# Altium project gelistirme_karti1.PrjPcb (part 1 of 2)
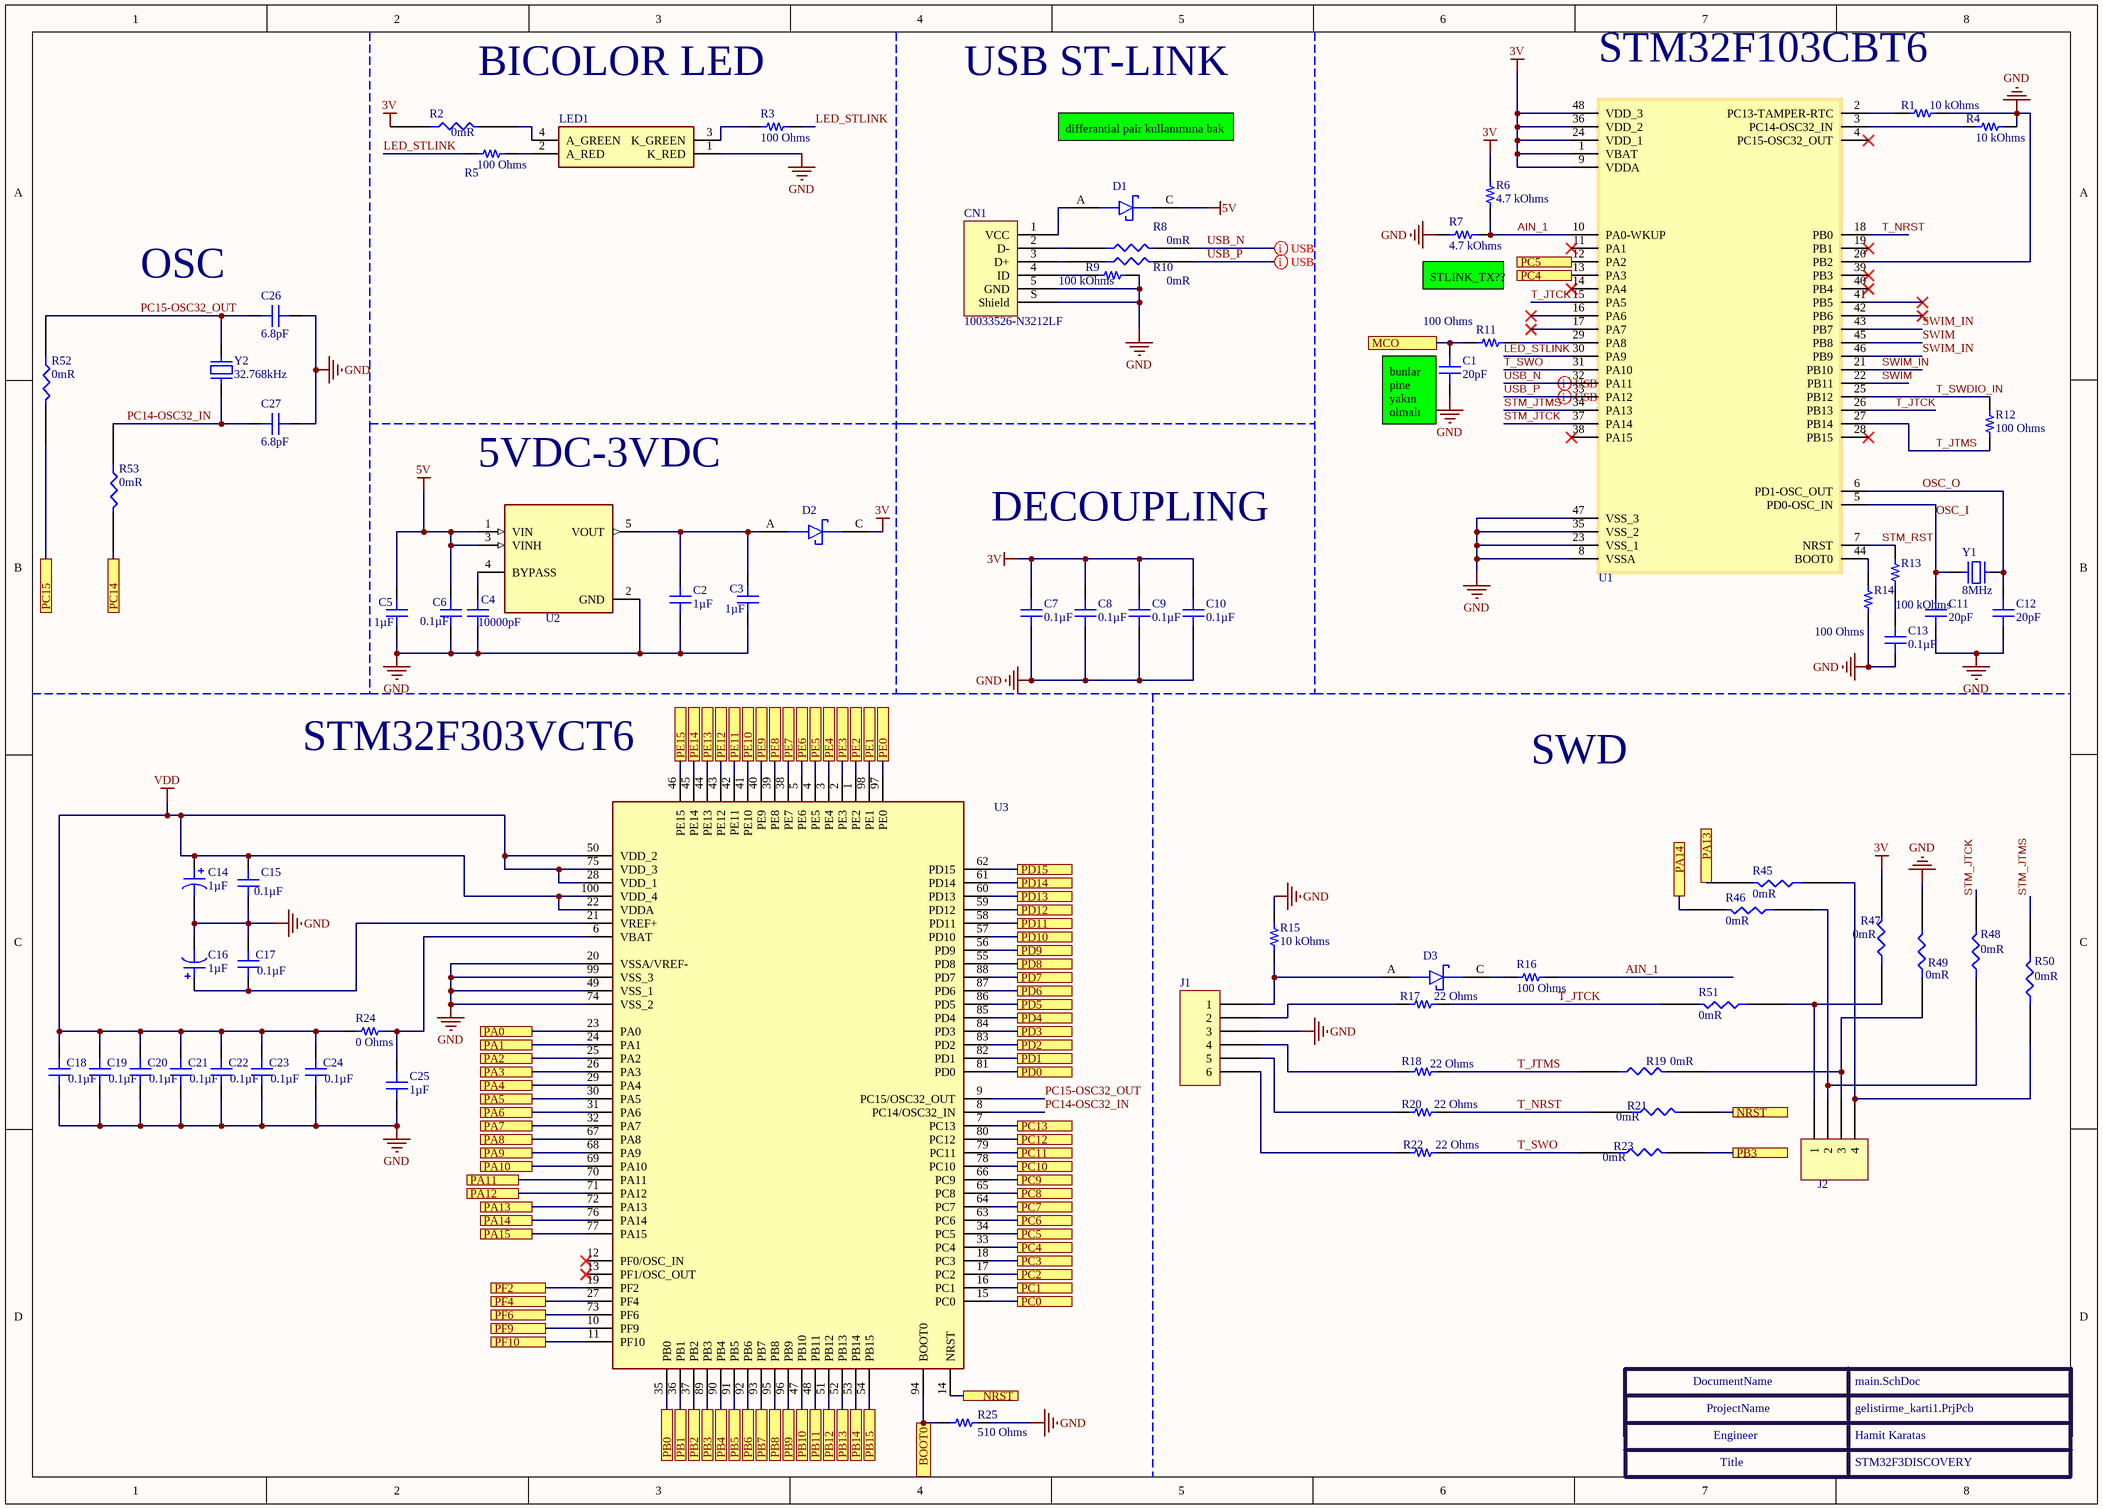
[diagram p0: main.SchDoc]
2 sheets, 118 parts. Net scope: flat (ports and power ports of the same name join across sheets).
Board file: PCB1.PcbDoc
Sheets:
  main.SchDoc
  IOandSensors.SchDoc

## Sheet main.SchDoc: STM32F3DISCOVERY
size A3; Engineer: Hamit Karatas; SheetNumber: 1; SheetTotal: 2

### Parts
C1  20pF  [CAP 0603_1608]
C2  1µF  [CAP 0603_1608]
C3  1µF  [CAP 0603_1608]
C4  10000pF  [CAP 0603_1608]
C5  1µF  [CAP 0603_1608]
C6  0.1µF  [CAP 0603_1608]
C7  0.1µF  [CAP 0603_1608]
C8  0.1µF  [CAP 0603_1608]
C9  0.1µF  [CAP 0603_1608]
C10  0.1µF  [CAP 0603_1608]
C11  20pF  [CAP 0603_1608]
C12  20pF  [CAP 0603_1608]
C13  0.1µF  [CAP 0603_1608]
C14  1µF  [CAP ALSMD POLY 4.3MM H5.5MM]
C15  0.1µF  [CAP 0603_1608]
C16  1µF  [CAP ALSMD POLY 4.3MM H5.5MM]
C17  0.1µF  [CAP 0603_1608]
C18  0.1µF  [CAP 0603_1608]
C19  0.1µF  [CAP 0603_1608]
C20  0.1µF  [CAP 0603_1608]
C21  0.1µF  [CAP 0603_1608]
C22  0.1µF  [CAP 0603_1608]
C23  0.1µF  [CAP 0603_1608]
C24  0.1µF  [CAP 0603_1608]
C25  1µF  [CAP 0603_1608]
C26  6.8pF  [CAP 0603_1608]
C27  6.8pF  [CAP 0603_1608]
CN1  10033526-N3212LF  [FCI USB 10033526-N3212LF]
D1  BAT60J  [SOD-323]  (value not drawn)
D2  BAT60J  [SOD-323]  (value not drawn)
D3  BAT60J  [SOD-323]  (value not drawn)
J1  B6B-PH-K(LF)(SN)  [JST B6B-PH-K]  (value not drawn)
J2  B4B-PH-K-S(LF)(SN)  [JST B4B-PH-K]  (value not drawn)
LED1  IN-S85DATRG  [INS85DATRG]  (value not drawn)
R1  10 kOhms  [RES 0603_1608]
R2  Resistance: 0mR  [RES_0603]  (hidden comment: RC0603JR-070RL)
R3  100 Ohms  [RES 0603_1608]
R4  10 kOhms  [RES 0603_1608]
R5  100 Ohms  [RES 0603_1608]
R6  4.7 kOhms  [RES 0603_1608]
R7  4.7 kOhms  [RES 0603_1608]
R8  Resistance: 0mR  [RES_0603]  (hidden comment: RC0603JR-070RL)
R9  100 kOhms  [RES 0603_1608]
R10  Resistance: 0mR  [RES_0603]  (hidden comment: RC0603JR-070RL)
R11  100 Ohms  [RES 0603_1608]
R12  100 Ohms  [RES 0603_1608]
R13  100 kOhms  [RES 0603_1608]
R14  100 Ohms  [RES 0603_1608]
R15  10 kOhms  [RES 0603_1608]
R16  100 Ohms  [RES 0603_1608]
R17  22 Ohms  [RES 0603_1608]
R18  22 Ohms  [RES 0603_1608]
R19  Resistance: 0mR  [RES_0603]  (hidden comment: RC0603JR-070RL)
R20  22 Ohms  [RES 0603_1608]
R21  Resistance: 0mR  [RES_0603]  (hidden comment: RC0603JR-070RL)
R22  22 Ohms  [RES 0603_1608]
R23  Resistance: 0mR  [RES_0603]  (hidden comment: RC0603JR-070RL)
R24  0 Ohms  [RES 0603_1608]
R25  510 Ohms  [RES 0603_1608]
R45  Resistance: 0mR  [RES_0603]  (hidden comment: RC0603JR-070RL)
R46  Resistance: 0mR  [RES_0603]  (hidden comment: RC0603JR-070RL)
R47  Resistance: 0mR  [RES_0603]  (hidden comment: RC0603JR-070RL)
R48  Resistance: 0mR  [RES_0603]  (hidden comment: RC0603JR-070RL)
R49  Resistance: 0mR  [RES_0603]  (hidden comment: RC0603JR-070RL)
R50  Resistance: 0mR  [RES_0603]  (hidden comment: RC0603JR-070RL)
R51  Resistance: 0mR  [RES_0603]  (hidden comment: RC0603JR-070RL)
R52  Resistance: 0mR  [RES_0603]  (hidden comment: RC0603JR-070RL)
R53  Resistance: 0mR  [RES_0603]  (hidden comment: RC0603JR-070RL)
U1  IC MCU 32BIT 128KB FLASH 48LQFP  [STM32F103CBT6]  (value not drawn)
U2  LD3985M33R  [SOT23-T]  (value not drawn)
U3  STM32F303VCT6  [LQFP-100]  (value not drawn)
Y1  8MHz  [ABRACON ABLS]
Y2  32.768kHz  [ABRACON ABS07]

### Ports
BOOT0, MCO, NRST, PA0, PA1, PA2, PA3, PA4, PA5, PA6, PA7, PA8, PA9, PA10, PA11, PA12, PA13, PA14, PA15, PB0, PB1, PB2, PB3, PB4, PB5, PB6, PB7, PB8, PB9, PB10, PB11, PB12, PB13, PB14, PB15, PC0, PC1, PC2, PC3, PC4, PC5, PC6, PC7, PC8, PC9, PC10, PC11, PC12, PC13, PC14, PC15, PD0, PD1, PD2, PD3, PD4, PD5, PD6, PD7, PD8, PD9, PD10, PD11, PD12, PD13, PD14, PD15, PE0, PE1, PE2, PE3, PE4, PE5, PE6, PE7, PE8, PE9, PE10, PE11, PE12, PE13, PE14, PE15, PF2, PF4, PF6, PF9, PF10

### Nets
3V: C7.2 C8.2 C9.2 C10.2 D2.C R2.1 R6.1 R47.2 U1.1(VBAT) U1.9(VDDA) U1.24(VDD_1) U1.36(VDD_2) U1.48(VDD_3)
5V: C5.2 C6.2 D1.C U2.1(VIN) U2.3(VINH)
GND: C1.1 C2.1 C3.1 C4.1 C5.1 C6.1 C7.1 C8.1 C9.1 C10.1 C11.1 C12.1 C13.1 C14.2 C15.1 C16.2 C17.2 C18.1 C19.1 C20.1 C21.1 C22.1 C23.1 C24.1 C25.1 C26.1 C27.1 CN1.5(GND) CN1.S(Shield) J1.3 LED1.1(K_RED) R1.2 R4.2 R7.2 R9.2 R14.1 R15.2 R25.2 R49.2 U1.8(VSSA) U1.20(PB2) U1.23(VSS_1) U1.35(VSS_2) U1.47(VSS_3) U2.2(GND) U3.20(VSSA/VREF-) U3.49(VSS_1) U3.74(VSS_2) U3.99(VSS_3)
VDD: C14.1 C15.2 C18.2 C19.2 C20.2 C21.2 C22.2 C23.2 C24.2 R24.2 U3.22(VDDA) U3.28(VDD_1) U3.50(VDD_2) U3.75(VDD_3) U3.100(VDD_4)
AIN_1: R6.2 R7.1 R16.2 U1.10(PA0-WKUP)
LED_STLINK: R3.2 R5.1 U1.30(PA9)
OSC_I: C11.2 U1.5(PD0-OSC_IN) Y1.2
OSC_O: C12.2 U1.6(PD1-OSC_OUT) Y1.1
PA9: U3.68(PA9) ; port PA9
PA13: R45.2 U3.72(PA13) ; port PA13
PA15: U3.77(PA15) ; port PA15
PB3: R23.2 U3.89(PB3) ; port PB3
PB5: U3.91(PB5) ; port PB5
PB7: U3.93(PB7) ; port PB7
PB9: U3.96(PB9) ; port PB9
PC9: U3.66(PC9) ; port PC9
PC11: U3.79(PC11) ; port PC11
PC13: U3.7(PC13) ; port PC13
PC14-OSC32_IN: C27.2 R53.1 U3.8(PC14/OSC32_IN) Y2.1
PC15: R52.2 ; port PC15
PC15-OSC32_OUT: C26.2 R52.1 U3.9(PC15/OSC32_OUT) Y2.2
PD0: U3.81(PD0) ; port PD0
PD2: U3.83(PD2) ; port PD2
PD4: U3.85(PD4) ; port PD4
PD6: U3.87(PD6) ; port PD6
PE1: U3.98(PE1) ; port PE1
PE3: U3.2(PE3) ; port PE3
PE5: U3.4(PE5) ; port PE5
PF10: U3.11(PF10) ; port PF10
STM_JTCK: R48.2 U1.37(PA14)
STM_JTMS: R50.2 U1.34(PA13)
STM_RST: R13.2 U1.7(NRST)
SWIM: U1.22(PB11) U1.45(PB8)
SWIM_IN: U1.21(PB10) U1.43(PB7) U1.46(PB9)
T_JTCK: R17.2 R51.2 U1.15(PA5) U1.26(PB13)
T_JTMS: R12.1 R18.2 R19.1 U1.27(PB14)
T_NRST: R20.2 R21.1 U1.18(PB0)
T_SWDIO_IN: R12.2 U1.25(PB12)
T_SWO: R22.2 R23.1 U1.31(PA10)
USB_N: R8.2 U1.32(PA11)
USB_P: R10.2 U1.33(PA12)
NetC1_2: C1.2 R11.2 ; port MCO
NetC2_2: C2.2 C3.2 D2.A U2.5(VOUT)
NetC4_2: C4.2 U2.4(BYPASS)
NetC13_2: C13.2 R13.1
NetC16_1: C16.1 C17.1 U3.21(VREF+)
NetC25_2: C25.2 R24.1 U3.6(VBAT)
NetCN1_1: CN1.1(VCC) D1.A
NetCN1_2: CN1.2(D-) R8.1
NetCN1_3: CN1.3(D+) R10.1
NetCN1_4: CN1.4(ID) R9.1
NetD3_A: D3.A J1.1 R15.1
NetD3_C: D3.C R16.1
NetJ1_2: J1.2 R17.1
NetJ1_4: J1.4 R18.1
NetJ1_5: J1.5 R20.1
NetJ1_6: J1.6 R22.1
NetJ2_1: J2.1 R47.1 R51.1
NetJ2_2: J2.2 R46.1 R48.1
NetJ2_3: J2.3 R19.2 R49.1
NetJ2_4: J2.4 R45.1 R50.1
NetLED1_2: LED1.2(A_RED) R5.2
NetLED1_3: LED1.3(K_GREEN) R3.1
NetLED1_4: LED1.4(A_GREEN) R2.2
NetP1_3: U3.10(PF9) ; port PF9
NetP1_7: R53.2 ; port PC14
NetP1_9: U3.5(PE6) ; port PE6
NetP1_11: U3.3(PE4) ; port PE4
NetP1_13: U3.1(PE2) ; port PE2
NetP1_15: U3.97(PE0) ; port PE0
NetP1_17: U3.95(PB8) ; port PB8
NetP1_19: R25.1 U3.94(BOOT0) ; port BOOT0
NetP1_21: U3.92(PB6) ; port PB6
NetP1_23: U3.90(PB4) ; port PB4
NetP1_25: U3.88(PD7) ; port PD7
NetP1_27: U3.86(PD5) ; port PD5
NetP1_29: U3.84(PD3) ; port PD3
NetP1_31: U3.82(PD1) ; port PD1
NetP1_33: U3.80(PC12) ; port PC12
NetP1_35: U3.78(PC10) ; port PC10
NetP1_37: R46.2 U3.76(PA14) ; port PA14
NetP1_39: U3.73(PF6) ; port PF6
NetP1_41: U3.71(PA12) ; port PA12
NetP1_42: U3.70(PA11) ; port PA11
NetP1_43: U3.69(PA10) ; port PA10
NetP1_45: U3.67(PA8) ; port PA8
NetP1_47: U3.65(PC8) ; port PC8
NetP2_4: R21.2 U3.14(NRST) ; port NRST
NetP2_5: U3.16(PC1) ; port PC1
NetP2_6: U3.15(PC0) ; port PC0
NetP2_7: U3.18(PC3) ; port PC3
NetP2_8: U3.17(PC2) ; port PC2
NetP2_9: U3.24(PA1) ; port PA1
NetP2_10: U3.19(PF2) ; port PF2
NetP2_11: U3.26(PA3) ; port PA3
NetP2_12: U3.23(PA0) ; port PA0
NetP2_13: U3.27(PF4) ; port PF4
NetP2_14: U3.25(PA2) ; port PA2
NetP2_15: U3.30(PA5) ; port PA5
NetP2_16: U3.29(PA4) ; port PA4
NetP2_17: U3.32(PA7) ; port PA7
NetP2_18: U3.31(PA6) ; port PA6
NetP2_19: U1.12(PA2) U3.34(PC5) ; port PC5
NetP2_20: U1.13(PA3) U3.33(PC4) ; port PC4
NetP2_21: U3.36(PB1) ; port PB1
NetP2_22: U3.35(PB0) ; port PB0
NetP2_23: U3.38(PE7) ; port PE7
NetP2_24: U3.37(PB2) ; port PB2
NetP2_25: U3.40(PE9) ; port PE9
NetP2_26: U3.39(PE8) ; port PE8
NetP2_27: U3.42(PE11) ; port PE11
NetP2_28: U3.41(PE10) ; port PE10
NetP2_29: U3.44(PE13) ; port PE13
NetP2_30: U3.43(PE12) ; port PE12
NetP2_31: U3.46(PE15) ; port PE15
NetP2_32: U3.45(PE14) ; port PE14
NetP2_33: U3.48(PB11) ; port PB11
NetP2_34: U3.47(PB10) ; port PB10
NetP2_35: U3.52(PB13) ; port PB13
NetP2_36: U3.51(PB12) ; port PB12
NetP2_37: U3.54(PB15) ; port PB15
NetP2_38: U3.53(PB14) ; port PB14
NetP2_39: U3.56(PD9) ; port PD9
NetP2_40: U3.55(PD8) ; port PD8
NetP2_41: U3.58(PD11) ; port PD11
NetP2_42: U3.57(PD10) ; port PD10
NetP2_43: U3.60(PD13) ; port PD13
NetP2_44: U3.59(PD12) ; port PD12
NetP2_45: U3.62(PD15) ; port PD15
NetP2_46: U3.61(PD14) ; port PD14
NetP2_47: U3.63(PC6) ; port PC6
NetP2_48: U3.64(PC7) ; port PC7
NetR1_1: R1.1 U1.2(PC13-TAMPER-RTC)
NetR4_1: R4.1 U1.3(PC14-OSC32_IN)
NetR11_1: R11.1 U1.29(PA8)
NetR14_2: R14.2 U1.44(BOOT0)

Not connected (* = marked no-connect by the designer): U1 4(PC15-OSC32_OUT)* 11(PA1)* 14(PA4)* 16(PA6)* 17(PA7)* 19(PB1)* 28(PB15)* 38(PA15)* 39(PB3)* 40(PB4)* 41(PB5)* 42(PB6)*; U3 12(PF0/OSC_IN)* 13(PF1/OSC_OUT)*

### Layout directives
differential pair: USB_N, USB_P

### Notes on the sheet
- BICOLOR LED
- USB ST-LINK
- STM32F103CBT6
- differantial pair kullanımına bak
- OSC
- (near R7) STLINK_TX??
- (near C1) bunlar pine yakın olmalı
- 5VDC-3VDC
- DECOUPLING
- (near U3) STM32F303VCT6
- SWD
- DocumentName
- ProjectName
- Engineer
- Title

### Library data of the parts
C1 C11 C12 = SQCSVA200JAT1A: CAP CER 20PF 250V 0603; Manufacturer: AVX Corporation; Temperature Coefficient: A; Tolerance: ±5%; Part Number: SQCSVA200JAT1A; Value: 20pF; Applications: RF, Microwave, High Frequency; Capacitance: 20pF; ComponentLink1Description: Datasheet; ComponentLink1URL: http://datasheets.avx.com/sqcs-sqcf.pdf; ComponentLink2Description: DigiKey Link; ComponentLink2URL: http://digikey.com/product-detail/en/avx-corporation/SQCSVA200JAT1A/478-3506-1-ND/1000465; Device Package: 0603 (1608 Metric); Features: High Q, Low Loss; LastUpdated: 2.09.2020 01:03:34; Lifecycle Status: Active; Minimum Order: 1; Mounting Type: Surface Mount, MLCC; Operating Temperature: -55°C ~ 125°C; Package / Case: 0603 (1608 Metric); Packaging: TapeAndReel; PartId: 2985; Part Status: Active; Price: 0.22; Series: SQ; Size / Dimension: 0.063" L x 0.032" W (1.60mm x 0.81mm); Supplier 1: DigiKey; Supplier Part Number 1: 478-3506-1-ND; Thickness (Max): 0.030" (0.76mm); Voltage - Rated: 250V
C2 C3 C5 C25 = C0603C105K4RACAUTO: CAP CER 0603 1UF 16V X7R 10%; Manufacturer: KEMET; Part Number: C0603C105K4RACAUTO; Value: 1µF; Applications: Automotive, Bypass, Decoupling; Capacitance: 1µF; ComponentLink1Description: Datasheet; ComponentLink1URL: https://api.kemet.com/component-edge/download/datasheet/C0603C105K4RACAUTO.pdf; ComponentLink2Description: DigiKey Link; ComponentLink2URL: http://digikey.com/product-detail/en/kemet/C0603C105K4RACAUTO/399-17704-1-ND/8635855; Device Package: 0603 (1608 Metric); LastUpdated: 2.09.2020 01:03:36; Lifecycle Status: Active; Minimum Order: 1; Mounting Type: Surface Mount, MLCC; Operating Temperature: -55°C ~ 125°C; Package / Case: 0603 (1608 Metric); Packaging: TapeAndReel; PartId: 2179; Part Status: Active; Price: 0.02; Ratings: AEC-Q200; Series: SMD Auto X7R; Size / Dimension: 0.063" L x 0.031" W (1.60mm x 0.80mm); Supplier 1: DigiKey; Supplier Part Number 1: 399-17704-1-ND; Temperature Coefficient: X7R; Thickness (Max): 0.037" (0.95mm); Tolerance: ±10%; Voltage - Rated: 16V
C4 = C0603X103K1RAC3316: CAP CER 0603 10NF 100V X7R; Manufacturer: KEMET; Tolerance: ±10%; Part Number: C0603X103K1RAC3316; Value: 10000pF; Applications: Automotive, Boardflex Sensitive; Capacitance: 10000pF; ComponentLink1Description: Datasheet; ComponentLink1URL: https://api.kemet.com/component-edge/download/datasheet/C0603X103K1RAC3316.pdf; ComponentLink2Description: DigiKey Link; ComponentLink2URL: http://digikey.com/product-detail/en/kemet/C0603X103K1RAC3316/399-C0603X103K1RAC3316CT-ND/10315834; Device Package: 0603 (1608 Metric); Features: Soft Termination; LastUpdated: 2.09.2020 01:03:25; Lifecycle Status: Active; Minimum Order: 1; Mounting Type: Surface Mount, MLCC; Operating Temperature: -55°C ~ 125°C; Package / Case: 0603 (1608 Metric); Packaging: TapeAndReel; PartId: 8591; Part Status: Active; Price: 0.09; Ratings: AEC-Q200; Series: SMD Auto X7R VW80808; Size / Dimension: 0.063" L x 0.031" W (1.60mm x 0.80mm); Supplier 1: DigiKey; Supplier Part Number 1: 399-C0603X103K1RAC3316CT-ND; Temperature Coefficient: X7R; Thickness (Max): 0.037" (0.95mm); Voltage - Rated: 100V
C6-C10 C13 C15 C17-C24 = C0603C104K5RAC7411: CAP CER 0.1UF 50V X7R 0603; Manufacturer: KEMET; Tolerance: ±10%; Part Number: C0603C104K5RAC7411; Value: 0.1µF; Applications: Bypass, Decoupling; Capacitance: 0.1µF; ComponentLink1Description: Datasheet; ComponentLink1URL: https://api.kemet.com/component-edge/download/datasheet/C0603C104K5RAC7411.pdf; ComponentLink2Description: DigiKey Link; ComponentLink2URL: http://digikey.com/product-detail/en/kemet/C0603C104K5RAC7411/399-7374-2-ND/3317013; Device Package: 0603 (1608 Metric); LastUpdated: 2.09.2020 01:03:36; Lifecycle Status: Active; Minimum Order: 15000; Mounting Type: Surface Mount, MLCC; Operating Temperature: -55°C ~ 125°C; Package / Case: 0603 (1608 Metric); Packaging: TapeAndReel; PartId: 2233; Part Status: Active; Price: 0.02; Series: SMD Comm X7R; Size / Dimension: 0.063" L x 0.031" W (1.60mm x 0.80mm); Supplier 1: DigiKey; Supplier Part Number 1: 399-7374-2-ND; Temperature Coefficient: X7R; Thickness (Max): 0.035" (0.90mm); Voltage - Rated: 50V
C14 C16 = EEE-1HA010NR: CAP ALUM 1UF 20% 50V SMD; Manufacturer: Panasonic Electronic Components; Lifetime @ Temp.: 2000 Hrs @ 85°C; Polarization: Bi-Polar; Ripple Current @ High Frequency: 17mA @ 10kHz; Ripple Current @ Low Frequency: 10mA @ 120Hz; Surface Mount Land Size: 0.169" L x 0.169" W (4.30mm x 4.30mm); Part Number: EEE-1HA010NR; Applications: Automotive; Capacitance: 1µF; ComponentLink1Description: Datasheet; ComponentLink1URL: //media.digikey.com/pdf/Data%20Sheets/Panasonic%20Electronic%20Components/S_Series,Type_V_Rev2018.pdf; ComponentLink2Description: DigiKey Link; ComponentLink2URL: http://digikey.com/product-detail/en/panasonic-electronic-components/EEE-1HA010NR/PCE4301CT-ND/946236; Device Package: Radial, Can - SMD; Height - Seated (Max): 0.213" (5.40mm); LastUpdated: 2.09.2020 01:23:46; Lifecycle Status: Active; Minimum Order: 1; Mounting Type: Surface Mount; Operating Temperature: -40°C ~ 85°C; Package / Case: Radial, Can - SMD; Packaging: TapeAndReel; PartId: 7035; Part Status: Active; Price: 0.08; Ratings: AEC-Q200; Series: S; Size / Dimension: 0.157" Dia (4.00mm); Supplier 1: DigiKey; Supplier Part Number 1: PCE4301CT-ND; Tolerance: ±20%; Value: 1µF; Voltage - Rated: 50V
C26 C27 = C0603C689J5GACTU: CAP CER 6.8PF 50V C0G/NP0 0603; Manufacturer: KEMET; Temperature Coefficient: C0G, NP0; Tolerance: ±5%; Part Number: C0603C689J5GACTU; Value: 6.8pF; Applications: General Purpose; Capacitance: 6.8pF; ComponentLink1Description: Datasheet; ComponentLink1URL: https://api.kemet.com/component-edge/download/datasheet/C0603C689J5GACTU.pdf; ComponentLink2Description: DigiKey Link; ComponentLink2URL: http://digikey.com/product-detail/en/kemet/C0603C689J5GACTU/399-7957-1-ND/3471680; Device Package: 0603 (1608 Metric); Features: Low ESL; LastUpdated: 2.09.2020 01:03:35; Lifecycle Status: Active; Minimum Order: 1; Mounting Type: Surface Mount, MLCC; Operating Temperature: -55°C ~ 125°C; Package / Case: 0603 (1608 Metric); Packaging: TapeAndReel; PartId: 2398; Part Status: Active; Price: 0.08; Series: SMD Comm C0G; Size / Dimension: 0.063" L x 0.031" W (1.60mm x 0.80mm); Supplier 1: DigiKey; Supplier Part Number 1: 399-7957-1-ND; Thickness (Max): 0.034" (0.87mm); Voltage - Rated: 50V
CN1 = 10033526-N3212LF: CONN RCPT MINI USB B 5POS SMD RA; Manufacturer: Amphenol ICC (FCI); Connector Type: USB - mini B; Current Rating (Amps): 1A per Contact; Gender: Receptacle; Mating Cycles: 5000; Number of Contacts: 5; Number of Ports: 1; Shielding: Shielded; Voltage - Rated: 30V; Part Number: 10033526-N3212LF; ComponentLink1Description: Datasheet; ComponentLink1URL: http://www.amphenol-icc.com/media/wysiwyg/files/drawing/10033526.pdf; ComponentLink2Description: DigiKey Link; ComponentLink2URL: //digikey.com/product-detail/en/amphenol-icc-fci/10033526-N3212LF/609-4700-2-ND/4292074; Features: Board Guide, Solder Retention; LastUpdated: 9.12.2019 20:52:14; Lifecycle Status: 0; Minimum Order: 1; Mounting Feature: Horizontal; Mounting Type: Surface Mount, Right Angle; Operating Temperature: -25°C ~ 85°C; Packaging: TapeAndReel; Part Status: Active; Price: 0.39; Series: -; Supplier 1: DigiKey; Supplier Part Number 1: 609-4700-2-ND; Termination: Solder
D1-D3 = DIODE SCHOTTKY: STMICROELECTRONICS - BAT60JFILM - Small Signal Schottky Diode, Single, 10 V, 3 A, 580 mV, 5 A, 150 °C; Forward Current: 3A; Max Reverse Current: 7.5uA; Peak Non-Repetitive Surge Current: 5A; Max Repetitive Reverse Voltage (Vrrm): 10V; Forward Voltage: 580mV; Polarity: Standard; Supplier 1: RSComponents; Manufacturer: STMicroelectronics; Manufacturer Part Number: BAT60JFILM; RoHS: Yes; Category: Rectifier Diodes; Stock 1: 1; Pricing 1: 100=0,09000, 500=0,08700, 1000=0,08500, 2500=0,08300, 5000=0,08100 (USD); Mount: Surface Mount; Number of Pins: 2; Weight: 0.01lb; Contact Plating: Tin,Matte; Min Operating Temperature: -65°C; Max Operating Temperature: 150°C; Element Configuration: Single; Packaging: Tape and Reel; Package Quantity: 1; Average Rectified Current: 3A; Voltage Rating (DC): 10V; Output Current: 3A; Current Rating: 3A; Max Reverse Voltage (DC): 10V; Series: -; Max Surge Current: 5A; Max Reverse Leakage Current: 7.5uA; Max Forward Surge Current (Ifsm): 5A; Length: 1.8mm; Width: 1.45mm; Height: 1.07mm; Radiation Hardening: No; Lead Free: Lead Free; RoHS Compliant: Yes; REACH SVHC: No SVHC; ComponentLink1URL: https://datasheet.ciiva.com/23916/cd00001944-23916545.pdf?src-supplier=Newark; ComponentLink1Description: https://datasheet.ciiva.com/23916/cd00001944-23916545.pdf?src-supplier=Newark; ComponentLink2URL: https://datasheet.ciiva.com/4714/cd00001944-96586-4714681.pdf?src-supplier=Mouser; ComponentLink2Description: https://datasheet.ciiva.com/4714/cd00001944-96586-4714681.pdf?src-supplier=Mouser; ComponentLink3URL: https://datasheet.ciiva.com/17078/bat60jfilm-17078717.pdf?src-supplier=Allied+Electronics; ComponentLink3Description: https://datasheet.ciiva.com/17078/bat60jfilm-17078717.pdf?src-supplier=Allied+Electronics; ComponentLink4URL: https://datasheet.ciiva.com/1200/1689728-1200741.pdf?src-supplier=Farnell; ComponentLink4Description: https://datasheet.ciiva.com/1200/1689728-1200741.pdf?src-supplier=Farnell; ComponentLink5URL: https://datasheet.ciiva.com/15144/getdatasheetpartid-91415-15144683.pdf?src-supplier=Verical; ComponentLink5Description: https://datasheet.ciiva.com/15144/getdatasheetpartid-91415-15144683.pdf?src-supplier=Verical; ComponentLink6URL: https://datasheet.ciiva.com/915/cd00001944-915607.pdf?src-supplier=Digi-Key; ComponentLink6Description: https://datasheet.ciiva.com/915/cd00001944-915607.pdf?src-supplier=Digi-Key; ComponentLink7URL: https://datasheet.ciiva.com/915/cd00001944-915608.pdf?src-supplier=Digi-Key; ComponentLink7Description: https://datasheet.ciiva.com/915/cd00001944-915608.pdf?src-supplier=Digi-Key; ComponentLink8URL: https://datasheet.ciiva.com/915/cd00001944-915609.pdf?src-supplier=Digi-Key; ComponentLink8Description: https://datasheet.ciiva.com/915/cd00001944-915609.pdf?src-supplier=Digi-Key; Supplier Part Number 1: 7146879
J1 = B6B-PH-K(LF)(SN): CONN HEADER VERT 6POS 2MM; Manufacturer: JST Sales America Inc.; Contact Length - Mating: 0.130" (3.30mm); Contact Length - Post: 0.134" (3.40mm); Current Rating (Amps): 2A; Material Flammability Rating: UL94 V-0; Number of Positions: 6; Number of Positions Loaded: All; Overall Contact Length: 0.333" (8.45mm); Pitch - Mating: 0.079" (2.00mm); Shrouding: Shrouded - 4 Wall; Style: Board to Cable/Wire; Voltage Rating: 100V; Part Number: B6B-PH-K(LF)(SN); ComponentLink1Description: Datasheet; ComponentLink1URL: http://www.jst-mfg.com/product/pdf/eng/ePH.pdf; ComponentLink2Description: DigiKey Link; ComponentLink2URL: http://digikey.com/product-detail/en/jst-sales-america-inc/B6B-PH-K-LF-SN/455-2923-ND/2741628; Connector Type: Header; Contact Finish - Mating: Tin; Contact Finish - Post: Tin; Contact Material: Brass; Contact Shape: Square; Contact Type: Male Pin; Fastening Type: Detent Lock; Insulation Color: Ivory; Insulation Height: 0.236" (6.00mm); Insulation Material: Polyamide (PA66), Nylon 6/6; LastUpdated: 12.01.2020 22:30:17; Lifecycle Status: Active; Minimum Order: 1; Mounting Type: Through Hole; Number of Rows: 1; Operating Temperature: -25°C ~ 85°C; Packaging: Bulk; PartId: 29; Part Status: Active; Price: 0.34; Series: PH; Supplier 1: DigiKey; Supplier Part Number 1: 455-2923-ND; Termination: Press-Fit, Solder
J2 = B4B-PH-K-S(LF)(SN): CONN HEADER VERT 4POS 2MM; Manufacturer: JST Sales America Inc.; Contact Length - Mating: 0.130" (3.30mm); Contact Length - Post: 0.134" (3.40mm); Current Rating (Amps): 2A; Material Flammability Rating: UL94 V-0; Number of Positions: 4; Number of Positions Loaded: All; Overall Contact Length: 0.333" (8.45mm); Pitch - Mating: 0.079" (2.00mm); Shrouding: Shrouded - 4 Wall; Style: Board to Cable/Wire; Voltage Rating: 100V; Part Number: B4B-PH-K-S(LF)(SN); ComponentLink1Description: Datasheet; ComponentLink1URL: http://www.jst-mfg.com/product/pdf/eng/ePH.pdf; ComponentLink2Description: DigiKey Link; ComponentLink2URL: http://digikey.com/product-detail/en/jst-sales-america-inc/B4B-PH-K-S-LF-SN/455-1706-ND/926613; Connector Type: Header; Contact Finish - Mating: Tin; Contact Finish - Post: Tin; Contact Material: Brass; Contact Shape: Square; Contact Type: Male Pin; Fastening Type: Detent Lock; Insulation Color: Natural; Insulation Height: 0.236" (6.00mm); Insulation Material: Polyamide (PA66), Nylon 6/6; LastUpdated: 12.01.2020 22:29:40; Lifecycle Status: Active; Minimum Order: 1; Mounting Type: Through Hole; Number of Rows: 1; Operating Temperature: -25°C ~ 85°C; Packaging: Bulk; PartId: 27; Part Status: Active; Price: 0.24; Series: PH; Supplier 1: DigiKey; Supplier Part Number 1: 455-1706-ND; Termination: Press-Fit, Solder
LED1 = IN-S85DATRG: LED; Manufacturer_Name: Inolux; Datasheet Link: http://www.inolux-corp.com/datasheet/SMDLED/Bi-Color%20Top%20View/IN-S85DATRG_V1.0.pdf; Height: 1.1mm; Manufacturer_Part_Number: IN-S85DATRG; Mouser Part Number: 743-IN-S85DATRG; Mouser Price/Stock: https://www.mouser.co.uk/ProductDetail/Inolux/IN-S85DATRG/?qs=fAHHVMwC%252BbiJ35CU790Hbw%3D%3D; Arrow Part Number: IN-S85DATRG; Arrow Price/Stock: https://www.arrow.com/en/products/in-s85datrg/inolux-corporation
R1 R4 R15 = RT0603DRD0710KL: RES SMD 10K OHM 0.5% 1/10W 0603; Manufacturer: Yageo; Power (Watts): 0.1W, 1/10W; Temperature Coefficient: ±25ppm/°C; Part Number: RT0603DRD0710KL; Value: 10 kOhms; ComponentLink1Description: Datasheet; ComponentLink1URL: https://www.yageo.com/upload/media/product/productsearch/datasheet/rchip/PYu-RT_1-to-0.01_RoHS_L_11.pdf; ComponentLink2Description: DigiKey Link; ComponentLink2URL: http://digikey.com/product-detail/en/yageo/RT0603DRD0710KL/311-10KDCT-ND/1035680; Composition: Thin Film; Device Package: 0603 (1608 Metric); Height - Seated (Max): 0.022" (0.55mm); LastUpdated: 2.09.2020 01:10:23; Lifecycle Status: Active; Minimum Order: 1; Number of Terminations: 2; Operating Temperature: -55°C ~ 155°C; Package / Case: 0603 (1608 Metric); Packaging: TapeAndReel; PartId: 5487; Part Status: Active; Price: 0.02; Resistance: 10 kOhms; Series: RT; Size / Dimension: 0.063" L x 0.031" W (1.60mm x 0.80mm); Supplier 1: DigiKey; Supplier Part Number 1: 311-10KDCT-ND; Supplier Device Package: 0603; Tolerance: ±0.5%
R2 R8 R10 R19 R21 R23 R45-R53 = Res 0 ohm 0603: RES SMD 0 OHM JUMPER 1/10W 0603; Manufacturer: Yageo; Designed by: Hamit; Tolerance: 1%; Power Rating: 100mW; Voltage Rating (DC): 50V; Temperature Coefficient: 200ppm/°C; Resistance Tolerance: 5%; Supplier 1: Digi-Key; Manufacturer Part Number: RC0603JR-070RL; RoHS: Yes; Category: Chip SMD Resistors; Stock 1: 6474034; Pricing 1: 1=0,10000, 10=0,01700, 25=0,01240, 50=0,00940, 100=0,00700, 250=0,00532, 500=0,00424, 1000=0,00313 (USD); Case/Package: 0603; Number of Pins: 2; Contact Plating: Tin,Matte; Case Code (Imperial): 0603; Case Code (Metric): 1608; Size Code: 0603; Min Operating Temperature: -55°C; Max Operating Temperature: 155°C; Resistor Type: Thick Film; Packaging: Tape and Reel; Termination: SMD/SMT; Series: RC; Technology: THICK FILM; Package Quantity: 5000; Voltage Rating: 50V; Features: Moisture Resistant; Max Power Dissipation: 100mW; Number of Terminations: 2; Construction: Rectangular; Length: 1.6mm; Width: 0.8mm; Height: 0.45mm; Depth: 0.8mm; Radiation Hardening: No; REACH SVHC: No SVHC; Lead Free: Lead Free; RoHS Compliant: Yes; Military Standard: Not; Supplier Part Number 1: 311-0.0GRDKR-ND
R3 R5 R11 R12 R14 R16 = RNCS0603BKE100R: RES 100 OHM 0.1% 1/16W 0603; Manufacturer: Stackpole Electronics Inc; Power (Watts): 0.063W, 1/16W; Temperature Coefficient: ±25ppm/°C; Part Number: RNCS0603BKE100R; Value: 100 Ohms; ComponentLink1Description: Datasheet; ComponentLink1URL: https://www.seielect.com/catalog/sei-rncs_rnch.pdf; ComponentLink2Description: DigiKey Link; ComponentLink2URL: http://digikey.com/product-detail/en/stackpole-electronics-inc/RNCS0603BKE100R/RNCS0603BKE100RCT-ND/1800117; Composition: Thin Film; Device Package: 0603 (1608 Metric); Features: Anti-Corrosive, Automotive AEC-Q200, Moisture Resistant; Height - Seated (Max): 0.022" (0.55mm); LastUpdated: 2.09.2020 01:10:25; Lifecycle Status: Active; Minimum Order: 1; Number of Terminations: 2; Operating Temperature: -55°C ~ 155°C; Package / Case: 0603 (1608 Metric); Packaging: TapeAndReel; PartId: 4839; Part Status: Active; Price: 0.08; Ratings: AEC-Q200; Resistance: 100 Ohms; Series: RNCS; Size / Dimension: 0.061" L x 0.031" W (1.55mm x 0.80mm); Supplier 1: DigiKey; Supplier Part Number 1: RNCS0603BKE100RCT-ND; Supplier Device Package: 0603; Tolerance: ±0.1%
R6 R7 = RT0603FRE074K7L: RES SMD 4.7K OHM 1% 1/10W 0603; Manufacturer: Yageo; Power (Watts): 0.1W, 1/10W; Temperature Coefficient: ±50ppm/°C; Part Number: RT0603FRE074K7L; Value: 4.7 kOhms; ComponentLink1Description: Datasheet; ComponentLink1URL: https://www.yageo.com/upload/media/product/productsearch/datasheet/rchip/PYu-RT_1-to-0.01_RoHS_L_11.pdf; ComponentLink2Description: DigiKey Link; ComponentLink2URL: http://digikey.com/product-detail/en/yageo/RT0603FRE074K7L/YAG1238CT-ND/4340591; Composition: Thin Film; Device Package: 0603 (1608 Metric); Height - Seated (Max): 0.022" (0.55mm); LastUpdated: 2.09.2020 01:10:23; Lifecycle Status: Active; Minimum Order: 1; Number of Terminations: 2; Operating Temperature: -55°C ~ 155°C; Package / Case: 0603 (1608 Metric); Packaging: TapeAndReel; PartId: 5678; Part Status: Active; Price: 0.01; Resistance: 4.7 kOhms; Series: RT; Size / Dimension: 0.063" L x 0.031" W (1.60mm x 0.80mm); Supplier 1: DigiKey; Supplier Part Number 1: YAG1238CT-ND; Supplier Device Package: 0603; Tolerance: ±1%
R9 R13 = AT0603DRD07100KL: RES SMD 100K OHM 0.5% 1/10W 0603; Manufacturer: Yageo; Power (Watts): 0.1W, 1/10W; Temperature Coefficient: ±25ppm/°C; Part Number: AT0603DRD07100KL; Value: 100 kOhms; ComponentLink1Description: Datasheet; ComponentLink1URL: http://www.yageo.com/documents/recent/PYu-AT_51_RoHS_L_5.pdf; ComponentLink2Description: DigiKey Link; ComponentLink2URL: http://digikey.com/product-detail/en/yageo/AT0603DRD07100KL/311-2103-1-ND/6128522; Composition: Thin Film; Device Package: 0603 (1608 Metric); Features: Anti-Sulfur, Automotive AEC-Q200, Moisture Resistant; Height - Seated (Max): 0.022" (0.55mm); LastUpdated: 2.09.2020 01:10:25; Lifecycle Status: Active; Minimum Order: 1; Number of Terminations: 2; Operating Temperature: -55°C ~ 155°C; Package / Case: 0603 (1608 Metric); Packaging: TapeAndReel; PartId: 4903; Part Status: Active; Price: 0.02; Ratings: AEC-Q200; Resistance: 100 kOhms; Series: AT; Size / Dimension: 0.063" L x 0.031" W (1.60mm x 0.80mm); Supplier 1: DigiKey; Supplier Part Number 1: 311-2103-1-ND; Supplier Device Package: 0603; Tolerance: ±0.5%
R17 R18 R20 R22 = RK73B1JTTD220J: RES 22 OHM 5% 1/8W 0603; Manufacturer: KOA Speer Electronics, Inc.; Power (Watts): 0.125W, 1/8W; Temperature Coefficient: ±200ppm/°C; Part Number: RK73B1JTTD220J; Value: 22 Ohms; ComponentLink1Description: Datasheet; ComponentLink1URL: http://www.koaspeer.com/catimages/Products/RK73B/RK73B.pdf; ComponentLink2Description: DigiKey Link; ComponentLink2URL: http://digikey.com/product-detail/en/koa-speer-electronics-inc/RK73B1JTTD220J/2019-RK73B1JTTD220JCT-ND/9846752; Composition: Thick Film; Device Package: 0603 (1608 Metric); Features: Automotive AEC-Q200, Moisture Resistant; Height - Seated (Max): 0.022" (0.55mm); LastUpdated: 2.09.2020 01:10:23; Lifecycle Status: Active; Minimum Order: 1; Number of Terminations: 2; Operating Temperature: -55°C ~ 155°C; Package / Case: 0603 (1608 Metric); Packaging: CutTape; PartId: 5932; Part Status: Active; Price: 0.10; Ratings: AEC-Q200; Resistance: 22 Ohms; Series: RK73B; Size / Dimension: 0.063" L x 0.031" W (1.60mm x 0.80mm); Supplier 1: DigiKey; Supplier Part Number 1: 2019-RK73B1JTTD220JCT-ND; Supplier Device Package: 0603; Tolerance: ±5%
R24 = RC0603FR-070RL: RES SMD 0 OHM JUMPER 1/10W 0603; Manufacturer: Yageo; Power (Watts): 0.1W, 1/10W; Part Number: RC0603FR-070RL; Value: 0 Ohms; ComponentLink1Description: Datasheet; ComponentLink1URL: https://www.yageo.com/upload/media/product/productsearch/datasheet/rchip/PYu-RC_Group_51_RoHS_L_10.pdf; ComponentLink2Description: DigiKey Link; ComponentLink2URL: http://digikey.com/product-detail/en/yageo/RC0603FR-070RL/311-0.0HRCT-ND/4340584; Composition: Thick Film; Device Package: 0603 (1608 Metric); Features: Moisture Resistant; Height - Seated (Max): 0.022" (0.55mm); LastUpdated: 2.09.2020 01:09:45; Lifecycle Status: Active; Minimum Order: 1; Number of Terminations: 2; Operating Temperature: -55°C ~ 155°C; Package / Case: 0603 (1608 Metric); Packaging: CutTape; PartId: 22614; Part Status: Active; Price: 0.10; Resistance: 0 Ohms; Series: RC; Size / Dimension: 0.063" L x 0.031" W (1.60mm x 0.80mm); Supplier 1: DigiKey; Supplier Part Number 1: 311-0.0HRCT-ND; Supplier Device Package: 0603; Tolerance: Jumper
R25 = RN73R1JTTD5100B25: RES 510 OHM 0.1% 1/10W 0603; Manufacturer: KOA Speer Electronics, Inc.; Power (Watts): 0.1W, 1/10W; Temperature Coefficient: ±25ppm/°C; Part Number: RN73R1JTTD5100B25; Value: 510 Ohms; ComponentLink1Description: Datasheet; ComponentLink1URL: //media.digikey.com/pdf/Data%20Sheets/KOA%20Speer/RN73R_Type_DS.pdf; ComponentLink2Description: DigiKey Link; ComponentLink2URL: http://digikey.com/product-detail/en/koa-speer-electronics-inc/RN73R1JTTD5100B25/2019-RN73R1JTTD5100B25CT-ND/9991988; Composition: Metal Film; Device Package: 0603 (1608 Metric); Features: Moisture Resistant; Height - Seated (Max): 0.022" (0.55mm); LastUpdated: 2.09.2020 01:10:17; Lifecycle Status: Active; Minimum Order: 1; Number of Terminations: 2; Operating Temperature: -55°C ~ 155°C; Package / Case: 0603 (1608 Metric); Packaging: TapeAndReel; PartId: 8416; Part Status: Active; Price: 0.06; Resistance: 510 Ohms; Series: RN73R; Size / Dimension: 0.063" L x 0.031" W (1.60mm x 0.80mm); Supplier 1: DigiKey; Supplier Part Number 1: 2019-RN73R1JTTD5100B25CT-ND; Supplier Device Package: 0603; Tolerance: ±0.1%
U1 = STM32F103CBT6: MCU 32-bit STM32F1 ARM Cortex M3 RISC 128KB Flash 2.5V/3.3V 48-Pin LQFP Tray; Manufacturer: STMicroelectronics; Designed by: Hamit; RAM Size: 20KB; Max Power Dissipation: 363mW; Interface: I2C,SPI,USB,CAN,IrDA,UART,USART,LIN; Number of I/Os: 37; Number of Timers/Counters: 4; Max Supply Voltage: 3.6V; Frequency: 72MHz; Min Supply Voltage: 2V; Oscillator Type: Internal; Data Bus Width: 32b; Watchdog Timer: Yes; Peripherals: POR,PWM,WDT,DMA,Temp Sensor,I2C; Number of PWM Channels: 12; Number of ADC Channels: 10; Number of Bits: 32; Number of SPI Channels: 2; Supplier 1: RSComponents; Manufacturer Part Number: STM32F103CBT6; RoHS: Yes; Category: Microcontrollers; Stock 1: 1; Pricing 1: 1=6,96400, 10=5,89900, 100=5,12900, 250=4,84800, 500=4,35800 (USD); Case/Package: LQFP; Number of Pins: 48; Contact Plating: Gold; Min Operating Temperature: -40°C; Max Operating Temperature: 85°C; Package Quantity: 250; Packaging: Tray; Number of Programmable I/O: 37; Max Frequency: 72MHz; Memory Type: FLASH; Memory Size: 128KB; Core Architecture: ARM; Density: 128KB; Number of I2C Channels: 2; Address Bus Width: 32b; Series: STM32 F1; Termination: SMD/SMT; Length: 7mm; Width: 7.2mm; Height: 1.45mm; Radiation Hardening: No; REACH SVHC: No SVHC; Lead Free: Lead Free; RoHS Compliant: Yes; ComponentLink1URL: https://datasheet.ciiva.com/23669/1714663-23669200.pdf?src-supplier=Newark; ComponentLink1Description: https://datasheet.ciiva.com/23669/1714663-23669200.pdf?src-supplier=Newark; ComponentLink2URL: https://datasheet.ciiva.com/15122/getdatasheetpartid-92132-15122195.pdf?src-supplier=Verical; ComponentLink2Description: https://datasheet.ciiva.com/15122/getdatasheetpartid-92132-15122195.pdf?src-supplier=Verical; ComponentLink3URL: https://datasheet.ciiva.com/26820/stm32f103cbt6-26820680.pdf?src-supplier=IIIC; ComponentLink3Description: https://datasheet.ciiva.com/26820/stm32f103cbt6-26820680.pdf?src-supplier=IIIC; ComponentLink4URL: https://datasheet.ciiva.com/5752/cd00161566-5752838.pdf?src-supplier=Farnell; ComponentLink4Description: https://datasheet.ciiva.com/5752/cd00161566-5752838.pdf?src-supplier=Farnell; ComponentLink5URL: https://datasheet.ciiva.com/16540/cd00161566-16540806.pdf?src-supplier=Avnet+Asia; ComponentLink5Description: https://datasheet.ciiva.com/16540/cd00161566-16540806.pdf?src-supplier=Avnet+Asia; ComponentLink6URL: https://datasheet.ciiva.com/1502/cd00161566-1502328.pdf?src-supplier=Digi-Key; ComponentLink6Description: https://datasheet.ciiva.com/1502/cd00161566-1502328.pdf?src-supplier=Digi-Key; ComponentLink7URL: https://datasheet.ciiva.com/14100/pustm-arm-microcont-stm32f103-en-14100509.pdf?src-supplier=Distrelec; ComponentLink7Description: https://datasheet.ciiva.com/14100/pustm-arm-microcont-stm32f103-en-14100509.pdf?src-supplier=Distrelec; ComponentLink8URL: https://datasheet.ciiva.com/4840/cd00161566-4840398.pdf?src-supplier=Mouser; ComponentLink8Description: https://datasheet.ciiva.com/4840/cd00161566-4840398.pdf?src-supplier=Mouser; ComponentLink9URL: https://datasheet.ciiva.com/16219/cd00161566-16219150.pdf?src-supplier=Future+Electronics; ComponentLink9Description: https://datasheet.ciiva.com/16219/cd00161566-16219150.pdf?src-supplier=Future+Electronics; Supplier Part Number 1: 0402273P
U2 = voltage regulator_3v3 150mA: LDO Regulator Pos 3.3V 0.55A 5-Pin SOT-23 T/R; Manufacturer: STMicroelectronics; Min Input Voltage: 2.5V; Number of Outputs: 1; Max Input Voltage: 6V; Polarity: Positive; Quiescent Current: 150uA; Accuracy: 2%; Output Type: Fixed; Max Output Current: 150mA; Dropout Voltage: 400uV; Min Current Limit: 300mA; Input Bias Current: 85uA; Supplier 1: Digi-Key; Manufacturer Part Number: LD3985M33R; RoHS: Yes; Category: Voltage Regulators - Linear; Stock 1: 20758; Pricing 1: 1=0,87000, 10=0,77000, 25=0,72280, 100=0,59000, 250=0,54800, 500=0,46640, 1000=0,38500 (USD); Mount: Surface Mount; Case/Package: SOT-23-5; Number of Pins: 5; Weight: 0.000222oz; Min Operating Temperature: -40°C; Max Operating Temperature: 125°C; Output Voltage: 3.3V; Packaging: Cut Tape; Package Quantity: 3000; Output Current: 150mA; Number of Regulators: 1; Min Output Voltage: 3.3V; Output Voltage Accuracy: 2%; Series: LD3985; Length: 3mm; Width: 1.75mm; Height: 1.3mm; Radiation Hardening: No; Lead Free: Lead Free; RoHS Compliant: Yes; ComponentLink1URL: https://datasheet.ciiva.com/41440/001185181-da-01-en-ic-reg-ldo-3-3v-ld3985m33r-sot-23-5-stm-41440289.pdf?src-supplier=Conrad; ComponentLink1Description: https://datasheet.ciiva.com/41440/001185181-da-01-en-ic-reg-ldo-3-3v-ld3985m33r-sot-23-5-stm-41440289.pdf?src-supplier=Conrad; ComponentLink2URL: https://datasheet.ciiva.com/26905/ld3985m33r-26905032.pdf?src-supplier=IIIC; ComponentLink2Description: https://datasheet.ciiva.com/26905/ld3985m33r-26905032.pdf?src-supplier=IIIC; ComponentLink3URL: https://datasheet.ciiva.com/2042/cd00003395-2042198.pdf?src-supplier=Digi-Key; ComponentLink3Description: https://datasheet.ciiva.com/2042/cd00003395-2042198.pdf?src-supplier=Digi-Key; ComponentLink4URL: https://datasheet.ciiva.com/2042/cd00003395-2042199.pdf?src-supplier=Digi-Key; ComponentLink4Description: https://datasheet.ciiva.com/2042/cd00003395-2042199.pdf?src-supplier=Digi-Key; ComponentLink5URL: https://datasheet.ciiva.com/2042/cd00003395-2042200.pdf?src-supplier=Digi-Key; ComponentLink5Description: https://datasheet.ciiva.com/2042/cd00003395-2042200.pdf?src-supplier=Digi-Key; ComponentLink6URL: https://datasheet.ciiva.com/16591/cd00003395-16591967.pdf?src-supplier=Avnet+Europe; ComponentLink6Description: https://datasheet.ciiva.com/16591/cd00003395-16591967.pdf?src-supplier=Avnet+Europe; Supplier Part Number 1: 497-3504-1-ND
U3 = STM32F303VCT6: ARM Microcontrollers - MCU 32-Bit ARM Cortex M4 72MHz 256kB MCU FPU; Manufacturer: STMicroelectronics; Interface: I2C,SPI,USB,CAN,IrDA,UART,USART,LIN,I2S; Data Bus Width: 32b; Number of Timers/Counters: 10; RAM Size: 40KB; Number of I/Os: 87; Oscillator Type: Internal; Watchdog Timer: Yes; Memory Type: FLASH; Peripherals: POR,PWM,WDT,DMA,I2C; Number of USB Channels: 1; Max Supply Voltage: 3.6V; Min Supply Voltage: 2V; Number of SPI Channels: 3; Number of I2C Channels: 2; Number of ADC Channels: 39; Supplier 1: RSComponents; RoHS: Yes; Category: Microcontrollers; Stock 1: 1; Pricing 1: 1=9,05200, 10=8,17000, 25=7,79100, 100=6,76800, 250=6,46000 (USD); Case/Package: LQFP; Number of Pins: 100; Weight: 0.04653oz; Min Operating Temperature: -40°C; Max Operating Temperature: 85°C; Package Quantity: 90; Packaging: Tray; Core Architecture: ARM; Frequency: 72MHz; Number of Programmable I/O: 87; Max Frequency: 72MHz; Memory Size: 256KB; Number of UART Channels: 2; Series: STM32 F3; Length: 14.2mm; Width: 14.2mm; Height: 1.45mm; Radiation Hardening: No; REACH SVHC: No SVHC; Lead Free: Lead Free; RoHS Compliant: Yes; ComponentLink1URL: https://datasheet.ciiva.com/14666/0900766b81171360-14666656.pdf?src-supplier=RSComponents; ComponentLink1Description: https://datasheet.ciiva.com/14666/0900766b81171360-14666656.pdf?src-supplier=RSComponents; ComponentLink2URL: https://datasheet.ciiva.com/8055/1831499-8055017.pdf?src-supplier=Element14; ComponentLink2Description: https://datasheet.ciiva.com/8055/1831499-8055017.pdf?src-supplier=Element14; ComponentLink3URL: https://datasheet.ciiva.com/12071/dm00058181-12071726.pdf?src-supplier=Mouser; ComponentLink3Description: https://datasheet.ciiva.com/12071/dm00058181-12071726.pdf?src-supplier=Mouser; ComponentLink4URL: https://datasheet.ciiva.com/16490/dm00058181-16490974.pdf?src-supplier=Future+Electronics; ComponentLink4Description: https://datasheet.ciiva.com/16490/dm00058181-16490974.pdf?src-supplier=Future+Electronics; ComponentLink5URL: https://datasheet.ciiva.com/48687/001075617-da-01-en-mcu-32bt-256k-stm32f303vct6-lqfp-100-stm-48687702.pdf?src-supplier=Conrad; ComponentLink5Description: https://datasheet.ciiva.com/48687/001075617-da-01-en-mcu-32bt-256k-stm32f303vct6-lqfp-100-stm-48687702.pdf?src-supplier=Conrad; Supplier Part Number 1: 7724845
Y1 = ABLS-8.000MHZ-20-D-3-H-T: CRYSTAL 8.0000MHZ 20PF SMD; Manufacturer: Abracon LLC; ESR (Equivalent Series Resistance): 80 Ohms; Frequency Stability: ±35ppm; Frequency Tolerance: ±25ppm; Operating Mode: Fundamental; Part Number: ABLS-8.000MHZ-20-D-3-H-T; ComponentLink1Description: Datasheet; ComponentLink1URL: https://abracon.com/Resonators/abls.pdf; ComponentLink2Description: DigiKey Link; ComponentLink2URL: http://digikey.com/product-detail/en/abracon-llc/ABLS-8.000MHZ-20-D-3-H-T/535-14945-1-ND/9998022; Frequency: 8MHz; Height - Seated (Max): 0.165" (4.20mm); LastUpdated: 2.09.2020 01:21:45; Lifecycle Status: Active; Load Capacitance: 20pF; Minimum Order: 1; Mounting Type: Surface Mount; Operating Temperature: -40°C ~ 85°C; Package / Case: HC-49/US; Packaging: TapeAndReel; PartId: 170; Part Status: Active; Price: 0.18; Series: ABLS; Size / Dimension: 0.449" L x 0.185" W (11.40mm x 4.70mm); Supplier 1: DigiKey; Supplier Part Number 1: 535-14945-1-ND; Type: MHz Crystal; Value: 8MHz
Y2 = ABS07-32.768KHZ-6-4-T: CRYSTAL 32.7680KHZ 6PF SMD; Manufacturer: Abracon LLC; ESR (Equivalent Series Resistance): 70 kOhms; Frequency Tolerance: ±30ppm; Operating Mode: Fundamental; Part Number: ABS07-32.768KHZ-6-4-T; ComponentLink1Description: Datasheet; ComponentLink1URL: https://abracon.com/Resonators/ABS07.pdf; ComponentLink2Description: DigiKey Link; ComponentLink2URL: http://digikey.com/product-detail/en/abracon-llc/ABS07-32.768KHZ-6-4-T/535-15021-1-ND/9998098; Frequency: 32.768kHz; Height - Seated (Max): 0.035" (0.90mm); LastUpdated: 2.09.2020 01:21:47; Lifecycle Status: Active; Load Capacitance: 6pF; Minimum Order: 1; Mounting Type: Surface Mount; Operating Temperature: -40°C ~ 85°C; Package / Case: 2-SMD, No Lead; Packaging: TapeAndReel; PartId: 387; Part Status: Active; Price: 0.20; Series: ABS07; Size / Dimension: 0.126" L x 0.059" W (3.20mm x 1.50mm); Supplier 1: DigiKey; Supplier Part Number 1: 535-15021-1-ND; Type: kHz Crystal (Tuning Fork); Value: 32.768kHz